# EAGLE design BoosterBoard (EAGLE 9.6.2)
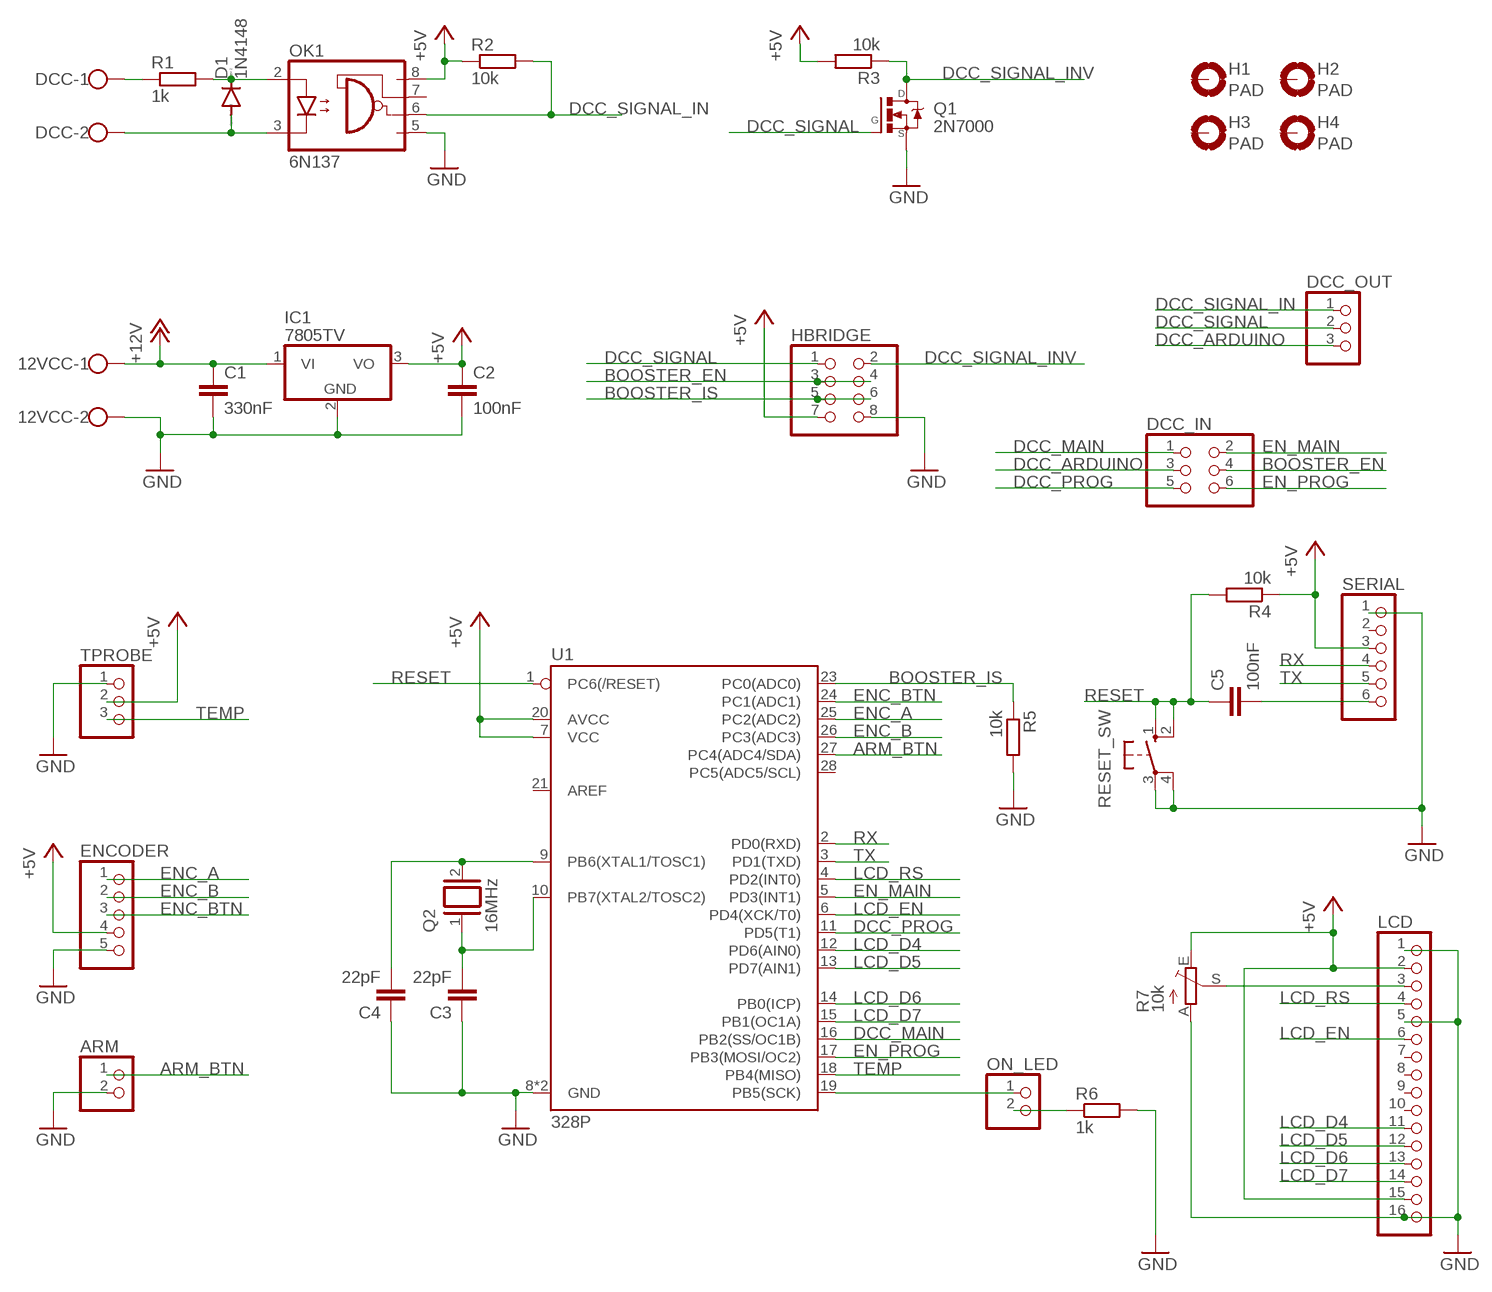
[diagram p0: schematic, sheet 1]

## Parts
12VCC  W237-102  [W237-102]
ARM  PINHD-1X2  [1X02]
C1  330nF  C-EU050-030X075  [C050-030X075]
C2  100nF  C-EU050-030X075  [C050-030X075]
C3  22pF  C-EU025-025X050  [C025-025X050]
C4  22pF  C-EU025-025X050  [C025-025X050]
C5  100nF  C-EU050-030X075  [C050-030X075]
D1  1N4148  1N4148DO35-10  [DO35-10]
DCC  W237-102  [W237-102]
DCC_IN  PINHD-2X3  [2X03]
DCC_OUT  PINHD-1X3  [1X03]
ENCODER  PINHD-1X5  [1X05]
H1  PAD  MOUNT-PAD-ROUND3.0  [3,0-PAD]
H2  PAD  MOUNT-PAD-ROUND3.0  [3,0-PAD]
H3  PAD  MOUNT-PAD-ROUND3.0  [3,0-PAD]
H4  PAD  MOUNT-PAD-ROUND3.0  [3,0-PAD]
HBRIDGE  PINHD-2X4  [2X04]
IC1  7805TV  [TO220V]
LCD  PINHD-1X16  [1X16]
OK1  6N137  [DIL08]
ON_LED  PINHD-1X2  [1X02]
Q1  2N7000  [TO-92]
Q2  16MHz  XTAL/S  [QS]
R1  1k  R-EU_0207/2V  [0207/2V]
R2  10k  R-EU_0207/2V  [0207/2V]
R3  10k  R-EU_0207/2V  [0207/2V]
R4  10k  R-EU_0207/2V  [0207/2V]
R5  10k  R-EU_0207/2V  [0207/2V]
R6  1k  R-EU_0207/2V  [0207/2V]
R7  10k  TRIM_EU-B64W  [B64W]
RESET_SW  10-XX  [B3F-10XX]
SERIAL  PINHD-1X6  [1X06]
TPROBE  PINHD-1X3  [1X03]
U1  328P  ATMEGA328P_PDIP  [DIP28]

## Nets
+5V: C2.1 ENCODER.4 HBRIDGE.7 IC1.3(VO) LCD.2 LCD.15 OK1.8(VCC) R2.1 R3.2 R4.1 R7.E SERIAL.3 TPROBE.2 U1.7(VCC) U1.20(AVCC)
+12V: 12VCC.1 C1.1 IC1.1(VI)
ARM_BTN: ARM.1 U1.27(PC4(ADC4/SDA))
BOOSTER_EN: DCC_IN.4 HBRIDGE.3 HBRIDGE.4
BOOSTER_IS: HBRIDGE.5 HBRIDGE.6 R5.1 U1.23(PC0(ADC0))
DCC_ARDUINO: DCC_IN.3 DCC_OUT.3
DCC_MAIN: DCC_IN.1 U1.16(PB2(SS/OC1B))
DCC_PROG: DCC_IN.5 U1.11(PD5(T1))
DCC_SIGNAL: DCC_OUT.2 HBRIDGE.1 Q1.2(G)
DCC_SIGNAL_IN: DCC_OUT.1 OK1.6(VO) R2.2
DCC_SIGNAL_INV: HBRIDGE.2 Q1.3(D) R3.1
EN_MAIN: DCC_IN.2 U1.5(PD3(INT1))
EN_PROG: DCC_IN.6 U1.17(PB3(MOSI/OC2))
ENC_A: ENCODER.1 U1.25(PC2(ADC2))
ENC_B: ENCODER.2 U1.26(PC3(ADC3))
ENC_BTN: ENCODER.3 U1.24(PC1(ADC1))
GND: 12VCC.2 ARM.2 C1.2 C2.2 C3.1 C4.1 ENCODER.5 HBRIDGE.8 IC1.2(GND) LCD.1 LCD.5 LCD.16 OK1.5(GND) Q1.1(S) R5.2 R6.2 R7.A RESET_SW.3(P) RESET_SW.4(P1) SERIAL.1 TPROBE.1 U1.8(GND) U1.22(GND)
LCD_D4: LCD.11 U1.12(PD6(AIN0))
LCD_D5: LCD.12 U1.13(PD7(AIN1))
LCD_D6: LCD.13 U1.14(PB0(ICP))
LCD_D7: LCD.14 U1.15(PB1(OC1A))
LCD_EN: LCD.6 U1.6(PD4(XCK/T0))
LCD_RS: LCD.4 U1.4(PD2(INT0))
N$1: DCC.1 R1.1
N$2: D1.C OK1.2(A) R1.2
N$3: D1.A DCC.2 OK1.3(C)
N$4: C4.2 Q2.2 U1.9(PB6(XTAL1/TOSC1))
N$5: C3.2 Q2.1 U1.10(PB7(XTAL2/TOSC2))
N$6: C5.2 SERIAL.6
N$7: ON_LED.1 U1.19(PB5(SCK))
N$8: ON_LED.2 R6.1
N$9: LCD.3 R7.S
RESET: C5.1 R4.2 RESET_SW.1(S) RESET_SW.2(S1) U1.1(PC6(/RESET))
RX: SERIAL.4 U1.2(PD0(RXD))
TEMP: TPROBE.3 U1.18(PB4(MISO))
TX: SERIAL.5 U1.3(PD1(TXD))
Unconnected: H1.B3,0(MOUNT) H2.B3,0(MOUNT) H3.B3,0(MOUNT) H4.B3,0(MOUNT) LCD.7 LCD.8 LCD.9 LCD.10 OK1.7(VE) SERIAL.2 U1.21(AREF) U1.28(PC5(ADC5/SCL))

## Library data of the parts
12VCC DCC = con-wago-500:W237-102: WAGO SCREW CLAMP; MPN: 237-102; OC_FARNELL: unknown; OC_NEWARK: 70K9898
ARM ON_LED = pinhead:PINHD-1X2: PIN HEADER
C1-C5 = rcl:C-EU: CAPACITOR, European symbol; SPICEPREFIX: C
D1 = diode:1N4148: DIODE high speed (Philips)
DCC_IN = pinhead:PINHD-2X3: PIN HEADER
DCC_OUT TPROBE = pinhead:PINHD-1X3: PIN HEADER
ENCODER = pinhead:PINHD-1X5: PIN HEADER
H1-H4 = holes:MOUNT-PAD-ROUND: MOUNTING PAD, round
HBRIDGE = pinhead:PINHD-2X4: PIN HEADER
IC1 = linear:78*: Positive VOLTAGE REGULATOR Source: http://cache.national.com/ds/LM/LM78L05.pdf http://www.fairchildsemi.com/ds/LM/LM7805.pdf
LCD = pinhead:PINHD-1X16: PIN HEADER
OK1 = optocoupler:6N137: MOTOROLA OPTO COUPLER; MPN: 6N137; OC_FARNELL: 1328376; OC_NEWARK: 52M1895
Q1 = transistor-fet:2N7000: N-Channel MOSFET
Q2 = special:XTAL/S: CRYSTAL
R1-R6 = rcl:R-EU_: RESISTOR, European symbol; SPICEPREFIX: R
R7 = pot:TRIM_EU-: POTENTIOMETER
RESET_SW = switch-omron:10-XX: OMRON SWITCH; MPN: B3F-1000; OC_FARNELL: 176432; OC_NEWARK: 36M3542
SERIAL = pinhead:PINHD-1X6: PIN HEADER
U1 = SparkFun-IC-Microcontroller:ATMEGA328P_PDIP: Atmel 328P Through hole ATMEGA328P uC used in the Arduino 32kb flash, 1k EEPROM, 2k SRAM Datasheet <http://www.sparkfun.com/datasheets/Components/SMD/ATMega328.pdf> SparkFun Products Storefront component: AVR 28 Pin 20MHz 32K 6A/D - ATMega328P <https://www.sparkfun.com/products/9061> (COM-09061) SparkFun Simon Says - Through-Hole Soldering Kit <https://www.sparkfun.com/products/10547> (KIT-10547) SparkFun Learn to Solder - Simon Says <https://www.sparkfun.com/products/13708> (KIT-13708) SparkFun BigTime Watch Kit <https://www.sparkfun.com/products/11734> (KIT-11734) SparkFun ClockIt <https://www.sparkfun.com/products/10930> (KIT-10930) SparkFun Serial Enabled LCD Kit <https://www.sparkfun.com/products/10097> (LCD-10097) SparkFun Simon Tilts - Through Hole Soldering Kit <https://www.sparkfun.com/products/12634> (KIT-12634) SparkFun Frequency Counter Kit <https://www.sparkfun.com/products/10140> (KIT-10140) FabFM Radio Kit <https://www.sparkfun.com/products/11043> (KIT-11043) SparkFun Binary Blaster Kit <https://www.sparkfun.com/products/12037> (KIT-12037) SparkFun Metro-Gnome <https://www.sparkfun.com/products/9236> (KIT-09236) ATmega328 with Arduino Optiboot (Uno) <https://www.sparkfun.com/products/10524> (DEV-10524); PROD_ID: IC-09136

## Net classes
0 default: width 0.254 mm

## Board
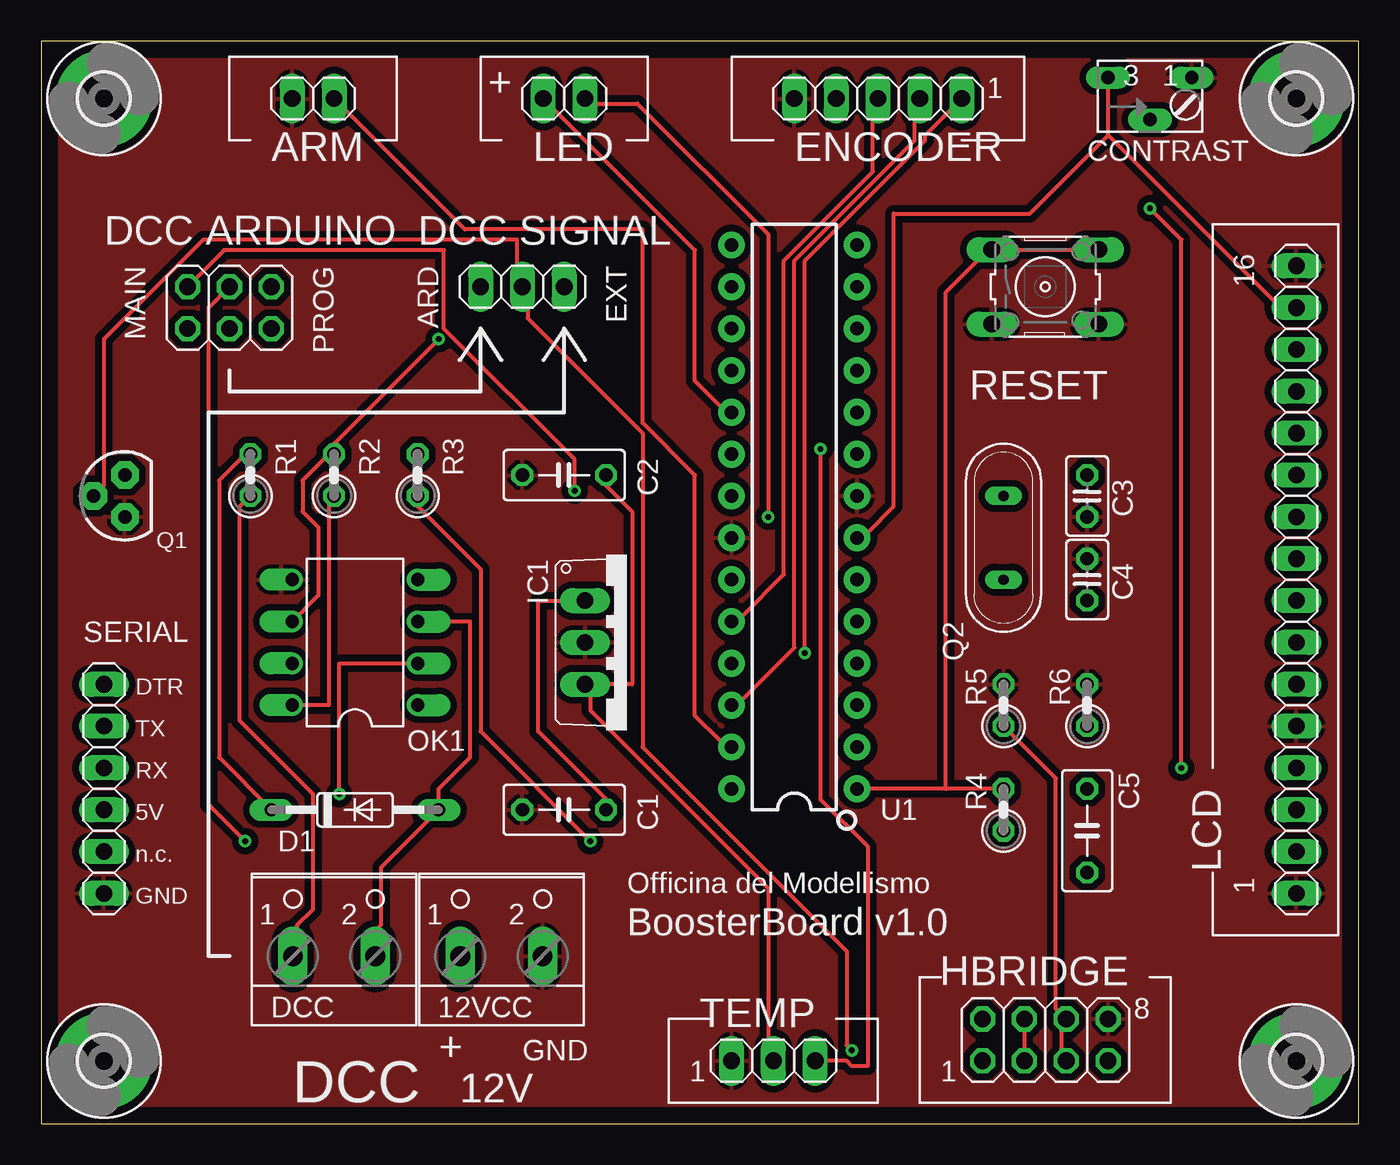
[diagram p1: board, top side]
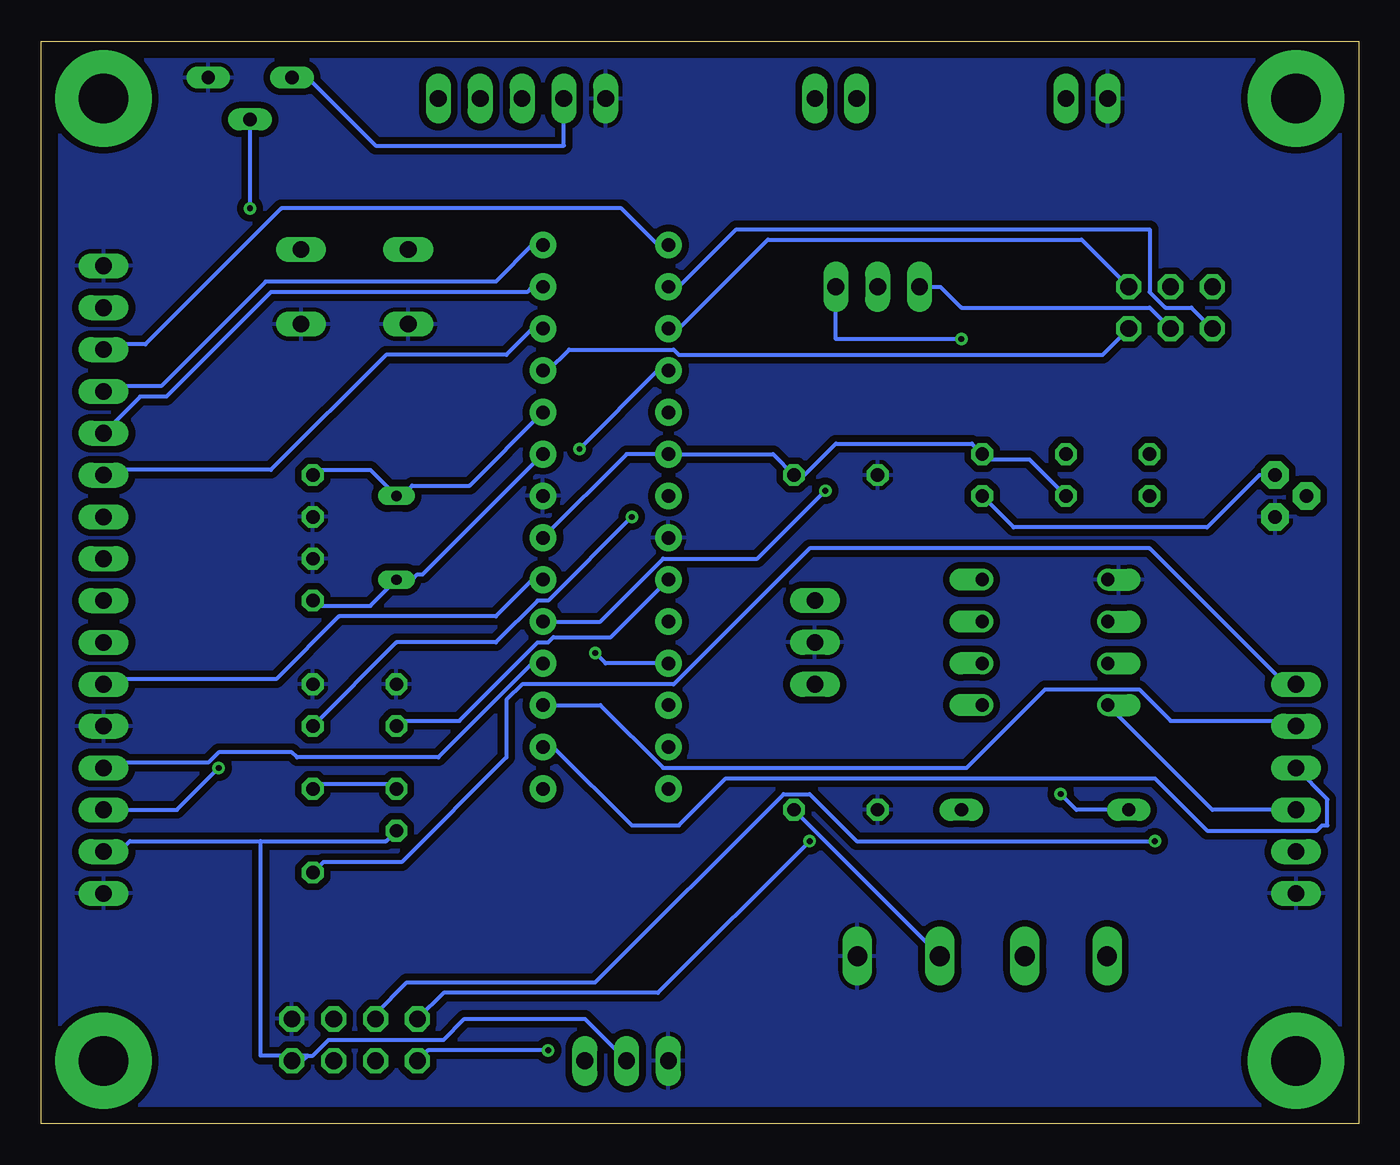
[diagram p2: board, bottom side, seen from below]

Size 79.99 x 65.71 mm. Coordinates in mm from the lower left corner, seen from the top.
Outline: 0,0 79.99,0 79.99,65.71 0,65.71 0,0
Copper layers (1*16): Top 0.035mm / dielectric 1.5mm / Bottom 0.035mm
Design rules "default": minimum track width 6mil, minimum drill 0.35mm, track to track 6mil, track to pad 6mil, pad to pad 6mil, via to via 6mil, smd to smd 6mil, copper to edge 40mil, drill to drill 6mil, minimum pad ring 10mil, minimum via ring 8mil, stop-mask expansion 4mil, vias tented up to drill 0mil, thermal gap 10mil
vRestrict: area 11.4,58.4 to 21.6,61; area 26.7,58.4 to 36.8,61; area 41.9,58.4 to 59.7,61; area 62.2,58.4 to 72.4,59.7; area 35.6,11.4 to 55.9,15.2; area 69.8,15.2 to 72.4,21.6; area 38.1,5.1 to 50.8,7.6; area 53.3,7.6 to 68.6,10.2; area 2.5,29.2 to 8.9,30.5; area 5.1,12.7 to 8.9,27.9; area 8.9,41.9 to 33,45.7; area 25.4,45.7 to 33,48.3; 10 more areas

### Footprints (pad centres in the part's own frame; a part is rotated, then mirrored left to right if it is on the bottom)
W237-102 = drill 1.194 long: 1 -2.5,-1.27; 2 2.5,-1.27
1X02 = drill 1.016 long: 1 -1.27,0; 2 1.27,0
C050-030X075 = drill 0.813 octagon: 1 -2.54,0; 2 2.54,0
C025-025X050 = drill 0.813 octagon: 1 -1.27,0; 2 1.27,0
DO35-10 = drill 0.813 long: A 5.08,0; C -5.08,0
2X03 = drill 1.016 octagon: 1 -2.54,-1.27; 2 -2.54,1.27; 3 0,-1.27; 4 0,1.27; 5 2.54,-1.27; 6 2.54,1.27
1X03 = drill 1.016 long: 1 -2.54,0; 2 0,0; 3 2.54,0
1X05 = drill 1.016 long: 1 -5.08,0; 2 -2.54,0; 3 0,0; 4 2.54,0; 5 5.08,0
3,0-PAD = drill 3 pad 5.842: B3,0 0,0
2X04 = drill 1.016 octagon: 1 -3.81,-1.27; 2 -3.81,1.27; 3 -1.27,-1.27; 4 -1.27,1.27; 5 1.27,-1.27; 6 1.27,1.27; 7 3.81,-1.27; 8 3.81,1.27
TO220V = drill 1.016 long: 1 -2.54,-2.54; 2 0,-2.54; 3 2.54,-2.54
1X16 = drill 1.016 long: 1 -19.05,0; 2 -16.51,0; 3 -13.97,0; 4 -11.43,0; 5 -8.89,0; 6 -6.35,0; 7 -3.81,0; 8 -1.27,0; 9 1.27,0; 10 3.81,0; 11 6.35,0; 12 8.89,0; 13 11.43,0; 14 13.97,0; 15 16.51,0; 16 19.05,0
DIL08 = drill 0.813 offset: 1 -3.81,-3.81; 2 -1.27,-3.81; 3 1.27,-3.81; 4 3.81,-3.81; 5 3.81,3.81; 6 1.27,3.81; 7 -1.27,3.81; 8 -3.81,3.81
TO-92 = drill 0.813 pad 1.676 octagon: 1 -1.27,0; 2 0,1.905; 3 1.27,0
QS = drill 0.61 long: 1 -2.54,0; 2 2.54,0
0207/2V = drill 0.813 octagon: 1 -1.27,0; 2 1.27,0
B64W = drill 0.813 long: A 2.54,0; E -2.54,0; S 0,-2.54
B3F-10XX = drill 1.016 long: 1 -3.251,2.261; 2 3.251,2.261; 3 -3.251,-2.261; 4 3.251,-2.261
1X06 = drill 1.016 long: 1 -6.35,0; 2 -3.81,0; 3 -1.27,0; 4 1.27,0; 5 3.81,0; 6 6.35,0
DIP28 = drill 0.813 pad 1.626: 1 -16.51,-3.81; 2 -13.97,-3.81; 3 -11.43,-3.81; 4 -8.89,-3.81; 5 -6.35,-3.81; 6 -3.81,-3.81; 7 -1.27,-3.81; 8 1.27,-3.81; 9 3.81,-3.81; 10 6.35,-3.81; 11 8.89,-3.81; 12 11.43,-3.81; 13 13.97,-3.81; 14 16.51,-3.81; 15 16.51,3.81; 16 13.97,3.81; 17 11.43,3.81; 18 8.89,3.81; 19 6.35,3.81; 20 3.81,3.81; 21 1.27,3.81; 22 -1.27,3.81; 23 -3.81,3.81; 24 -6.35,3.81; 25 -8.89,3.81; 26 -11.43,3.81; 27 -13.97,3.81; 28 -16.51,3.81

### Placement (x,y rotation side)
12VCC  27.94,11.43 0 top
ARM  16.51,62.23 180 top
C1  31.75,19.05 180 top
C2  31.75,39.37 180 top
C3  63.5,38.1 90 top
C4  63.5,33.02 270 top
C5  63.5,17.78 270 top
D1  19.05,19.05 0 top
DCC  17.78,11.43 0 top
DCC_IN  11.43,49.53 0 top
DCC_OUT  29.21,50.8 180 top
ENCODER  50.8,62.23 180 top
H1  76.2,62.23 0 top
H2  3.81,62.23 0 top
H3  3.81,3.81 0 top
H4  76.2,3.81 0 top
HBRIDGE  60.96,5.08 0 top
IC1  35.56,29.21 270 top
LCD  76.2,33.02 90 top
OK1  19.05,29.21 90 top
ON_LED  31.75,62.23 0 top
Q1  5.08,38.1 90 top
Q2  58.42,35.56 270 top
R1  12.7,39.37 90 top
R2  17.78,39.37 90 top
R3  22.86,39.37 90 top
R4  58.42,19.05 90 top
R5  58.42,25.4 90 top
R6  63.5,25.4 90 top
R7  67.31,63.5 0 top
RESET_SW  60.96,50.8 0 top
SERIAL  3.81,20.32 90 top
TPROBE  44.45,3.81 0 top
U1  45.72,36.83 90 top

### Tracks (layer width: path | path; a pad name or v marks a point on that pad's centre or on a via)
+5V
  Top 0.254: 64.77,60.01 R7.E | 64.77,60.01 75.25,49.53 LCD.15 | 33.34,26.67 35.88,26.67 35.88,37.15 34.29,38.73 C2.1 | OK1.8 17.46,25.4 17.46,37.78 R2.1 | 64.77,60.01 60.01,55.24 51.75,55.24 51.75,37.47 50.16,35.88 49.53,35.88 U1.7 | TPROBE.2 44.13,4.13 44.13,14.29 33.34,25.08 33.34,26.67 | 33.34,26.67 IC1.3
  Bottom 0.254: R4.1 59.05,17.14 66.67,17.14 | 66.67,17.14 74.61,17.14 75.25,16.51 LCD.2 | TPROBE.2 46.99,6.35 54.29,6.35 55.56,5.08 62.55,5.08 63.5,4.13 63.82,4.13 | 63.82,4.13 64.14,3.81 HBRIDGE.7 | 66.67,17.14 66.67,4.13 63.82,4.13 | ENCODER.4 48.26,59.37 59.69,59.37 63.82,63.5 R7.E | OK1.8 8.89,19.05 SERIAL.3 | R2.1 20,40.32 22.54,40.32 R3.2 23.5,41.27 31.75,41.27 33.66,39.37 C2.1 35.56,40.64 U1.20 44.45,40.64 U1.7
+12V
  Top 0.254: IC1.1 30.16,31.75 30.16,23.81 34.29,19.68 C1.1
  Bottom 0.254: C1.1 25.4,10.16 12VCC.1
ARM_BTN
  Top 0.254: ARM.1 25.72,54.29 36.51,54.29 36.51,42.55 39.69,39.37 39.69,24.77 41.27,23.18 41.91,23.18 U1.27
BOOSTER_EN  (via drill 0.35)
  Top 0.254: HBRIDGE.4 HBRIDGE.3 | DCC_IN.4 10.16,49.53 10.16,19.37 v12.38,17.14
  Bottom 0.254: v12.38,17.14 30.48,17.14 33.34,20 34.92,20 46.35,8.57 57.78,8.57 59.69,6.67 HBRIDGE.4
BOOSTER_IS
  Top 0.254: R5.1 61.59,20.95 61.59,6.99 61.91,6.67 | HBRIDGE.5 61.91,4.13 61.91,6.67 | 61.91,6.67 HBRIDGE.6
  Bottom 0.254: U1.23 45.4,29.53 48.9,29.53 49.21,29.21 49.85,29.21 54.61,24.45 58.1,24.45 R5.1
DCC_ARDUINO
  Bottom 0.254: DCC_IN.3 12.7,49.53 24.13,49.53 25.4,50.8 DCC_OUT.3
DCC_MAIN
  Bottom 0.254: DCC_IN.1 10.16,49.53 11.75,49.53 12.7,50.48 12.7,54.29 37.78,54.29 41.27,50.8 U1.16
DCC_PROG
  Bottom 0.254: DCC_IN.5 15.56,46.67 41.27,46.67 41.59,46.99 47.94,46.99 49.21,45.72 U1.11
DCC_SIGNAL  (via drill 0.35)
  Top 0.254: v49.21,4.45 48.9,4.76 48.9,10.48 36.51,22.86 36.51,41.91 29.53,48.9 29.53,50.48 DCC_OUT.2 28.89,51.12 28.89,53.66 9.84,53.66 3.81,47.62 3.81,38.73 Q1.2
  Bottom 0.254: HBRIDGE.1 56.52,4.45 v49.21,4.45
DCC_SIGNAL_IN  (via drill 0.35)
  Top 0.254: OK1.6 16.83,32.07 16.83,36.2 15.88,37.15 15.88,39.05 17.46,40.64 R2.2 17.78,41.27 v24.13,47.62
  Bottom 0.254: DCC_OUT.1 31.75,47.62 v24.13,47.62
DCC_SIGNAL_INV  (via drill 0.35)
  Top 0.254: v33.34,17.14 26.67,23.81 26.67,33.66 22.86,37.47 R3.1
  Bottom 0.254: R3.1 20.95,36.2 9.21,36.2 6.03,39.37 Q1.3 | HBRIDGE.2 55.56,7.94 42.55,7.94 v33.34,17.14
EN_MAIN  (via drill 0.35)
  Top 0.254: DCC_IN.2 11.11,53.02 24.45,53.02 24.45,48.26 32.38,40.32 v32.38,38.42
  Bottom 0.254: v32.38,38.42 36.51,34.29 42.23,34.29 46.04,30.48 U1.5
EN_PROG
  Bottom 0.254: DCC_IN.6 16.83,53.66 35.88,53.66 41.27,48.26 U1.17
ENC_A  (via drill 0.35)
  Top 0.254: ENCODER.1 53.66,60.01 53.66,59.69 46.35,52.39 v46.35,28.57
  Bottom 0.254: v46.35,28.57 45.72,27.94 U1.25
ENC_B
  Top 0.254: ENCODER.2 53.02,61.91 53.02,59.69 45.72,52.39 45.72,28.89 42.55,25.72 41.91,25.72 U1.26
ENC_BTN
  Top 0.254: ENCODER.3 50.48,61.91 50.48,57.78 45.09,52.39 45.09,33.34 42.55,30.8 41.91,30.8 U1.24
GND
  pour Top (isolate 0.406): 0,66.04 80.01,66.04 80.01,0 0,0
  pour Bottom (isolate 0.406): 0,66.04 80.01,66.04 80.01,0 0,0
LCD_D4
  Bottom 0.254: LCD.11 75.88,39.69 66.04,39.69 59.05,46.67 51.75,46.67 50.16,48.26 U1.12
LCD_D5
  Bottom 0.254: LCD.12 73.98,44.13 72.39,44.13 66.04,50.48 50.48,50.48 50.16,50.8 U1.13
LCD_D6
  Bottom 0.254: LCD.13 75.88,44.77 72.71,44.77 66.36,51.12 52.39,51.12 50.16,53.34 U1.14
LCD_D7
  Bottom 0.254: LCD.14 75.88,47.31 73.66,47.31 65.41,55.56 44.77,55.56 42.55,53.34 U1.15
LCD_EN
  Bottom 0.254: LCD.6 75.88,26.99 65.72,26.99 61.91,30.8 52.39,30.8 50.16,33.02 U1.6
LCD_RS
  Bottom 0.254: LCD.4 75.88,21.91 69.85,21.91 69.22,22.54 64.77,22.54 64.45,22.23 55.88,22.23 50.16,27.94 U1.4
N$1
  Top 0.254: R1.1 12.06,37.47 12.06,24.45 16.51,20 16.51,13.02 15.56,12.06 15.56,10.16 DCC.1
N$2  (via drill 0.35)
  Top 0.254: D1.C 10.79,22.23 10.79,39.05 12.38,40.64 R1.2 | OK1.2 18.1,27.94 v18.1,20
  Bottom 0.254: v18.1,20 17.14,19.05 D1.C
N$3
  Top 0.254: DCC.2 20.32,10.16 20.32,11.75 20.64,12.06 20.64,15.56 D1.A 24.13,20.32 26.04,22.23 26.04,30.48 OK1.3
N$4
  Bottom 0.254: C4.2 63.18,31.43 60.01,31.43 Q2.2 57.47,33.02 57.15,33.34 56.83,33.34 U1.9
N$5
  Bottom 0.254: C3.2 63.18,39.69 60.01,39.69 Q2.1 58.1,38.1 57.47,38.73 53.98,38.73 U1.10
N$6
  Bottom 0.254: C5.2 62.87,15.88 58.1,15.88 51.75,22.23 51.75,25.72 50.8,26.67 41.59,26.67 33.34,34.92 12.7,34.92 4.45,26.67 SERIAL.6
N$7
  Top 0.254: ON_LED.1 39.69,53.02 39.69,45.09 41.27,43.5 41.91,43.5 U1.19
N$8  (via drill 0.35)
  Top 0.254: v44.13,36.83 44.13,53.98 36.2,61.91 33.02,61.91 ON_LED.2
  Bottom 0.254: R6.1 58.42,29.21 52.39,29.21 49.85,31.75 49.21,31.75 v44.13,36.83
N$9  (via drill 0.35)
  Top 0.254: v67.31,55.56 69.22,53.66 v69.22,21.59
  Bottom 0.254: v67.31,55.56 R7.S | v69.22,21.59 71.75,19.05 LCD.3
RESET
  Top 0.254: RESET_SW.2 64.14,53.02 57.78,53.02 RESET_SW.1 57.47,53.02 54.93,50.48 54.93,20.32 | R4.2 54.93,20.32 | 54.93,20.32 U1.1
  Bottom 0.254: R4.2 58.74,20.64 63.18,20.64 C5.1
RX
  Bottom 0.254: SERIAL.4 1.91,19.68 1.91,18.1 2.22,18.1 2.54,17.78 9.21,17.78 12.38,20.95 38.42,20.95 41.27,18.1 44.13,18.1 48.9,22.86 U1.2
TEMP  (via drill 0.35)
  Top 0.254: TPROBE.3 48.9,3.81 49.21,3.49 50.16,3.49 50.16,16.83 47.31,19.68 v47.31,40.96
  Bottom 0.254: v47.31,40.96 42.55,45.72 U1.18
TX
  Bottom 0.254: SERIAL.5 4.13,24.45 11.43,24.45 13.34,26.35 19.05,26.35 23.81,21.59 42.23,21.59 46.04,25.4 U1.3

### Text on the board
tNames: + | 1 | ARM | LED | ENCODER | CONTRAST | DCC ARDUINO | DCC SIGNAL | MAIN | PROG | ARD | EXT | 16 | RESET | SERIAL | DTR | TX | RX | LCD | 5V | n.c. | Officina del Modellismo | 1 | GND | BoosterBoard v1.0 | HBRIDGE | TEMP | 8 | + | GND | 1 | 1 | DCC | 12V